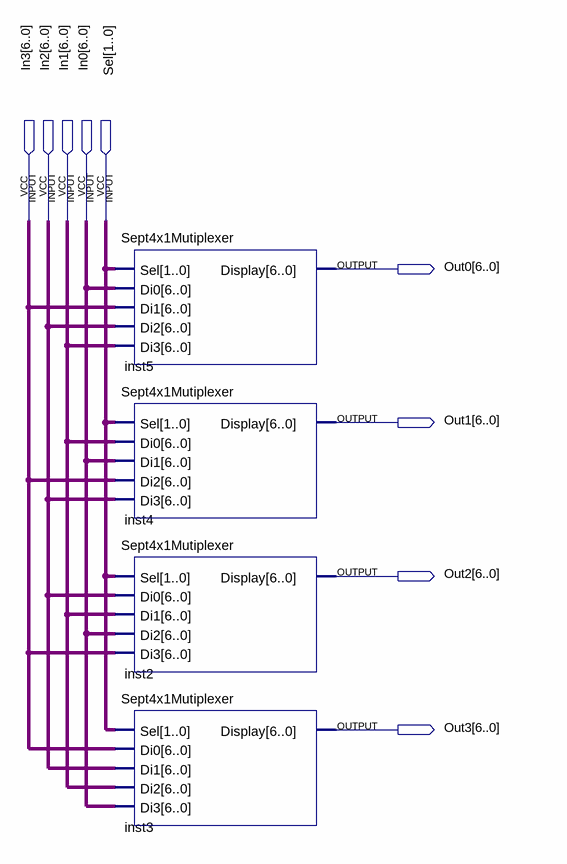
[diagram p0: schematic sheet]
// Quartus schematic Digit Shifter.bdf as structural Verilog: 4 symbols, 9 pins
module \Digit_Shifter  (
  input  [6:0] In3,
  input  [6:0] In2,
  input  [6:0] In1,
  input  [6:0] In0,
  input  [1:0] Sel,
  output [6:0] Out0,
  output [6:0] Out1,
  output [6:0] Out2,
  output [6:0] Out3
);

  Sept4x1Mutiplexer inst5 (.Sel(Sel), .Di0(In0), .Di1(In3), .Di2(In2), .Di3(In1), .Display(Out0));
  Sept4x1Mutiplexer inst4 (.Sel(Sel), .Di0(In1), .Di1(In0), .Di2(In3), .Di3(In2), .Display(Out1));
  Sept4x1Mutiplexer inst2 (.Sel(Sel), .Di0(In2), .Di1(In1), .Di2(In0), .Di3(In3), .Display(Out2));
  Sept4x1Mutiplexer inst3 (.Sel(Sel), .Di0(In3), .Di1(In2), .Di2(In1), .Di3(In0), .Display(Out3));
endmodule
